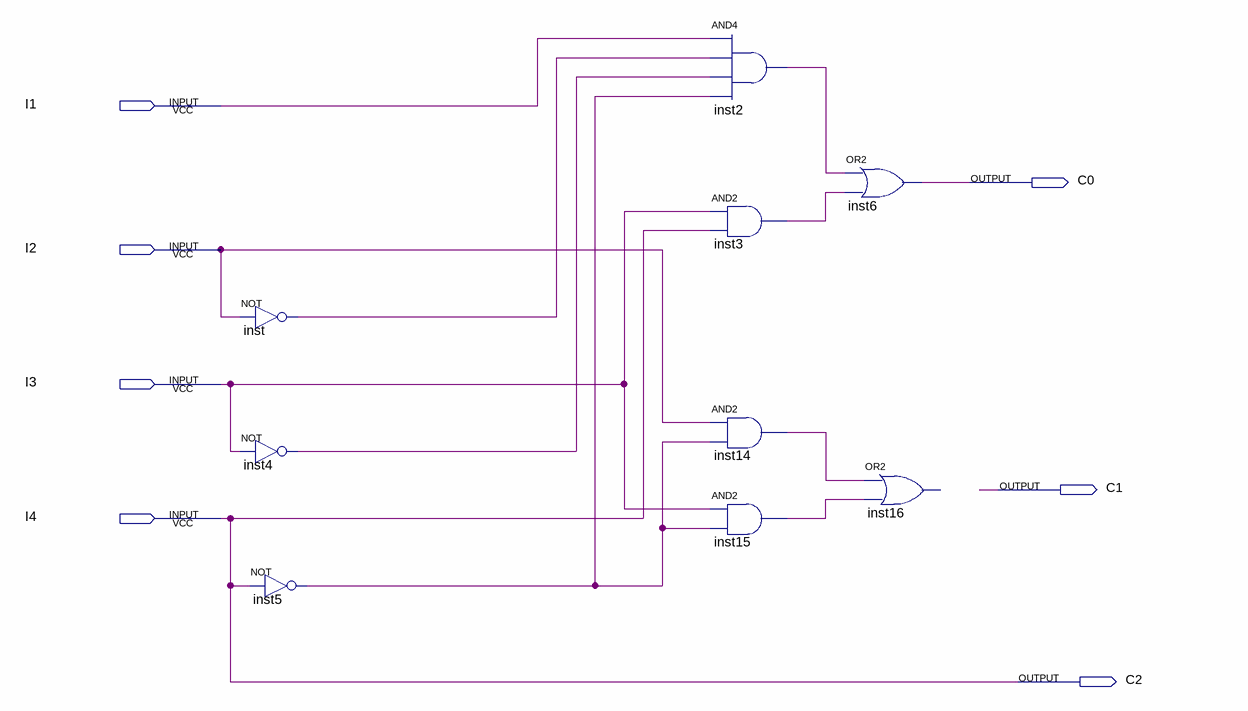
[diagram p0: schematic sheet]
// Quartus schematic Encoder.bdf as structural Verilog: 9 symbols, 7 pins
module Encoder (
  input  I1,
  input  I2,
  input  I3,
  input  I4,
  output C0,
  output C1,
  output C2
);

  wire inst2_out, inst3_out, inst4_out, inst5_out, inst14_out, inst15_out, inst_out;

  not inst (inst_out, I2);
  not inst4 (inst4_out, I3);
  not inst5 (inst5_out, I4);
  and inst2 (inst2_out, I1, inst_out, inst4_out, inst5_out);
  and inst3 (inst3_out, I3, I4);
  and inst14 (inst14_out, I2, inst5_out);
  and inst15 (inst15_out, I3, inst5_out);
  or inst6 (C0, inst2_out, inst3_out);
  // OR2 inst16 has open pins: IN1=inst14_out, IN2=inst15_out, OUT=open

  assign C2 = I4;
endmodule
